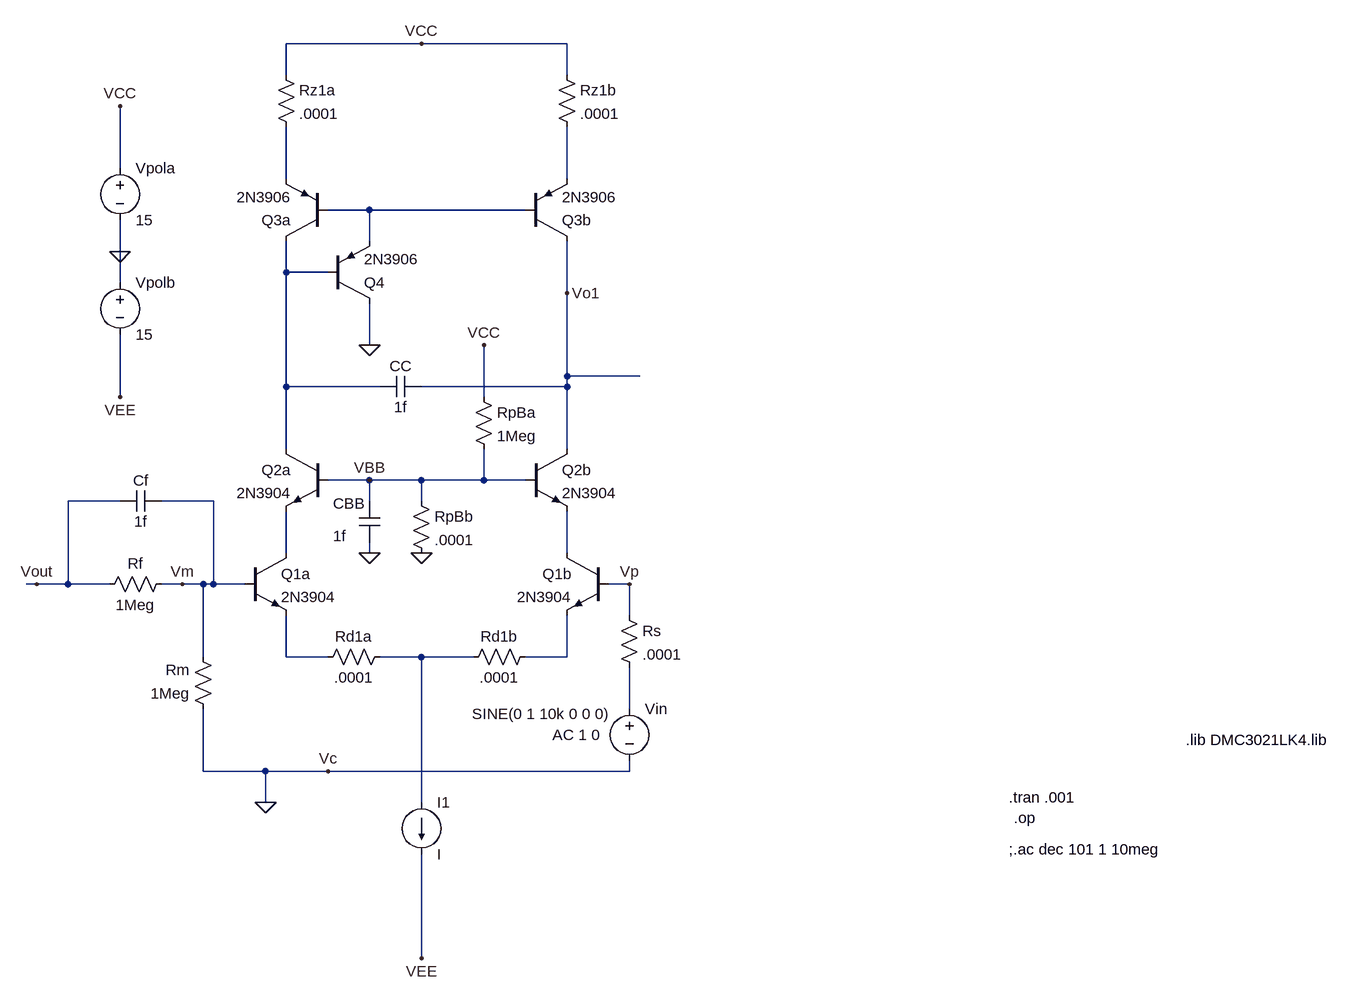
[diagram p0: schematic Etage_3_Total.asc]
Etage_3_Total.asc, the LTspice schematic file:
Version 4
SHEET 1 2404 1432
WIRE 288 -464 80 -464
WIRE 512 -464 288 -464
WIRE 80 -416 80 -464
WIRE 512 -416 512 -464
WIRE -176 -272 -176 -368
WIRE 80 -256 80 -336
WIRE 512 -256 512 -336
WIRE 208 -208 144 -208
WIRE 448 -208 208 -208
WIRE 208 -160 208 -208
WIRE -176 -144 -176 -192
WIRE 80 -112 80 -160
WIRE 144 -112 80 -112
WIRE -176 -96 -176 -144
WIRE 512 -80 512 -160
WIRE 208 0 208 -64
WIRE 512 48 512 -80
WIRE 624 48 512 48
WIRE 80 64 80 -112
WIRE 224 64 80 64
WIRE 512 64 512 48
WIRE 512 64 288 64
WIRE -176 80 -176 -16
WIRE 384 80 384 0
WIRE 80 160 80 64
WIRE 512 160 512 64
WIRE 208 208 144 208
WIRE 288 208 208 208
WIRE 384 208 384 160
WIRE 384 208 288 208
WIRE 448 208 384 208
WIRE -176 240 -256 240
WIRE -32 240 -112 240
WIRE 208 240 208 208
WIRE 288 240 288 208
WIRE 80 320 80 256
WIRE 208 320 208 304
WIRE 512 320 512 256
WIRE -304 368 -320 368
WIRE -256 368 -256 240
WIRE -256 368 -304 368
WIRE -192 368 -256 368
WIRE -80 368 -112 368
WIRE -48 368 -80 368
WIRE -32 368 -32 240
WIRE -32 368 -48 368
WIRE 16 368 -32 368
WIRE 608 368 576 368
WIRE 608 416 608 368
WIRE -48 480 -48 368
WIRE 80 480 80 416
WIRE 144 480 80 480
WIRE 288 480 224 480
WIRE 368 480 288 480
WIRE 512 480 512 416
WIRE 512 480 448 480
WIRE 608 560 608 496
WIRE -48 656 -48 560
WIRE 48 656 -48 656
WIRE 144 656 48 656
WIRE 608 656 608 640
WIRE 608 656 144 656
WIRE 48 704 48 656
WIRE 288 704 288 480
WIRE 288 944 288 784
FLAG 288 -464 VCC
FLAG -176 -368 VCC
FLAG -176 80 VEE
FLAG -176 -144 0
FLAG 288 320 0
FLAG 208 208 VBB
FLAG 512 -80 Vo1
FLAG 608 368 Vp
FLAG -80 368 Vm
FLAG 208 0 0
FLAG 384 0 VCC
FLAG 208 320 0
FLAG 144 656 Vc
FLAG -304 368 Vout
FLAG 48 704 0
FLAG 288 944 VEE
SYMBOL npn 16 320 R0
SYMATTR InstName Q1a
SYMATTR Value 2N3904
SYMBOL npn 576 320 M0
SYMATTR InstName Q1b
SYMATTR Value 2N3904
SYMBOL npn 448 160 R0
SYMATTR InstName Q2b
SYMATTR Value 2N3904
SYMBOL npn 144 160 M0
SYMATTR InstName Q2a
SYMATTR Value 2N3904
SYMBOL pnp 144 -160 R180
SYMATTR InstName Q3a
SYMATTR Value 2N3906
SYMBOL pnp 144 -64 M180
SYMATTR InstName Q4
SYMATTR Value 2N3906
SYMBOL pnp 448 -160 M180
SYMATTR InstName Q3b
SYMATTR Value 2N3906
SYMBOL res 64 -432 R0
SYMATTR InstName Rz1a
SYMATTR Value .0001
SYMBOL res 496 -432 R0
SYMATTR InstName Rz1b
SYMATTR Value .0001
SYMBOL voltage 608 544 R0
WINDOW 123 -118 56 Left 2
WINDOW 39 0 0 Left 0
WINDOW 3 -242 24 Left 2
SYMATTR Value2 AC 1 0
SYMATTR Value SINE(0 1 10k 0 0 0)
SYMATTR InstName Vin
SYMBOL voltage -176 -288 R0
WINDOW 123 0 0 Left 0
WINDOW 39 0 0 Left 0
SYMATTR InstName Vpola
SYMATTR Value 15
SYMBOL voltage -176 -112 R0
WINDOW 123 0 0 Left 0
WINDOW 39 0 0 Left 0
SYMATTR InstName Vpolb
SYMATTR Value 15
SYMBOL res -96 352 R90
WINDOW 0 0 56 VBottom 2
WINDOW 3 32 56 VTop 2
SYMATTR InstName Rf
SYMATTR Value 1Meg
SYMBOL res -32 576 R180
WINDOW 0 36 76 Left 2
WINDOW 3 36 40 Left 2
SYMATTR InstName Rm
SYMATTR Value 1Meg
SYMBOL res 592 400 R0
SYMATTR InstName Rs
SYMATTR Value .0001
SYMBOL res 272 224 R0
SYMATTR InstName RpBb
SYMATTR Value .0001
SYMBOL res 368 64 R0
SYMATTR InstName RpBa
SYMATTR Value 1Meg
SYMBOL cap 192 240 R0
WINDOW 0 -40 4 Left 2
WINDOW 3 -40 54 Left 2
SYMATTR InstName CBB
SYMATTR Value 1f
SYMBOL res 464 464 R90
WINDOW 0 0 56 VBottom 2
WINDOW 3 32 56 VTop 2
SYMATTR InstName Rd1b
SYMATTR Value .0001
SYMBOL res 240 464 R90
WINDOW 0 0 56 VBottom 2
WINDOW 3 32 56 VTop 2
SYMATTR InstName Rd1a
SYMATTR Value .0001
SYMBOL cap 288 48 R90
WINDOW 0 0 32 VBottom 2
WINDOW 3 32 32 VTop 2
SYMATTR InstName CC
SYMATTR Value 1f
SYMBOL cap -112 224 R90
WINDOW 0 0 32 VBottom 2
WINDOW 3 32 32 VTop 2
SYMATTR InstName Cf
SYMATTR Value 1f
SYMBOL current 288 704 R0
SYMATTR InstName I1
TEXT 1200 728 Left 2 !.op
TEXT 1192 776 Left 2 !;.ac dec 101 1 10meg
TEXT 1192 696 Left 2 !.tran .001
TEXT 1464 608 Left 2 !.lib DMC3021LK4.lib

The netlist it stands for:
* Etage_3_Total.asc
Q1a N005 Vm N007 0 2N3904
Q1b N006 Vp N009 0 2N3904
Q2b Vo1 VBB N006 0 2N3904
Q2a N004 VBB N005 0 2N3904
Q3a N004 N003 N001 0 2N3906
Q4 0 N004 N003 0 2N3906
Q3b Vo1 N003 N002 0 2N3906
Rz1a VCC N001 .0001
Rz1b VCC N002 .0001
Vin N010 0 SINE(0 1 10k 0 0 0) AC 1 0
Vpola VCC 0 15
Vpolb 0 VEE 15
Rf Vm Vout 1Meg
Rm 0 Vm 1Meg
Rs Vp N010 .0001
RpBb VBB 0 .0001
RpBa VCC VBB 1Meg
CBB VBB 0 1f
Rd1b N009 N008 .0001
Rd1a N008 N007 .0001
CC Vo1 N004 1f
Cf Vm Vout 1f
I1 N008 VEE I
.model NPN NPN
.model PNP PNP
.lib standard.bjt
.op
;.ac dec 101 1 10meg
.tran .001
.lib DMC3021LK4.lib
.backanno
.end